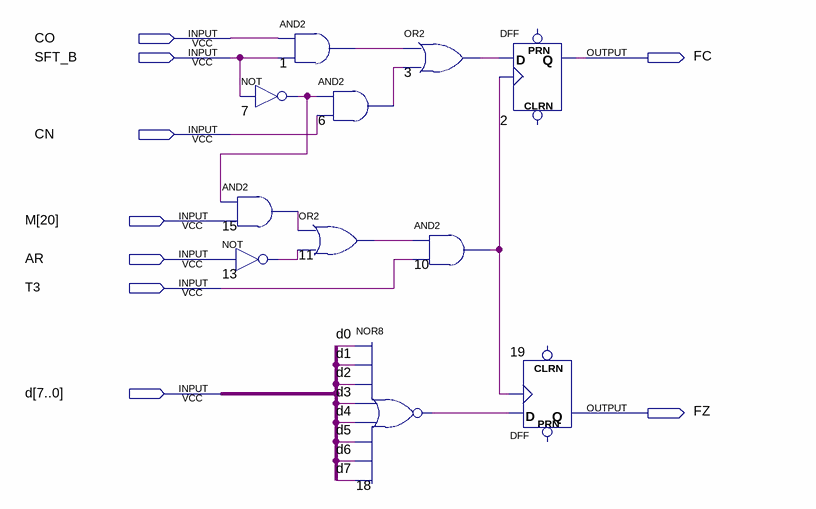
[diagram p0: schematic sheet]
// Quartus schematic Fc_z.bdf as structural Verilog: 11 symbols, 9 pins
module Fc_z (
  input  CO,
  input  SFT_B,
  input  CN,
  input  [20:20] M,
  input  AR,
  input  T3,
  input  [7:0] d,
  output FC,
  output FZ
);

  wire n1_out, n3_out, n6_out, n7_out, n10_out, n11_out, n13_out, n15_out, n18_out;

  not u_7 (n7_out, SFT_B);
  and u_15 (n15_out, n7_out, M[20]);
  not u_13 (n13_out, AR);
  and u_1 (n1_out, CO, SFT_B);
  and u_6 (n6_out, n7_out, CN);
  or u_11 (n11_out, n15_out, n13_out);
  or u_3 (n3_out, n1_out, n6_out);
  and u_10 (n10_out, n11_out, T3);
  nor u_18 (n18_out, d[0], d[1], d[2], d[3], d[4], d[5], d[6], d[7]);
  DFF u_2 (.CLK(n10_out), .D(n3_out), .Q(FC));  // open: CLRN, PRN
  DFF u_19 (.CLK(n10_out), .D(n18_out), .Q(FZ));  // open: CLRN, PRN
endmodule
